# EAGLE design artboat_rev_a (EAGLE 7.3.0)
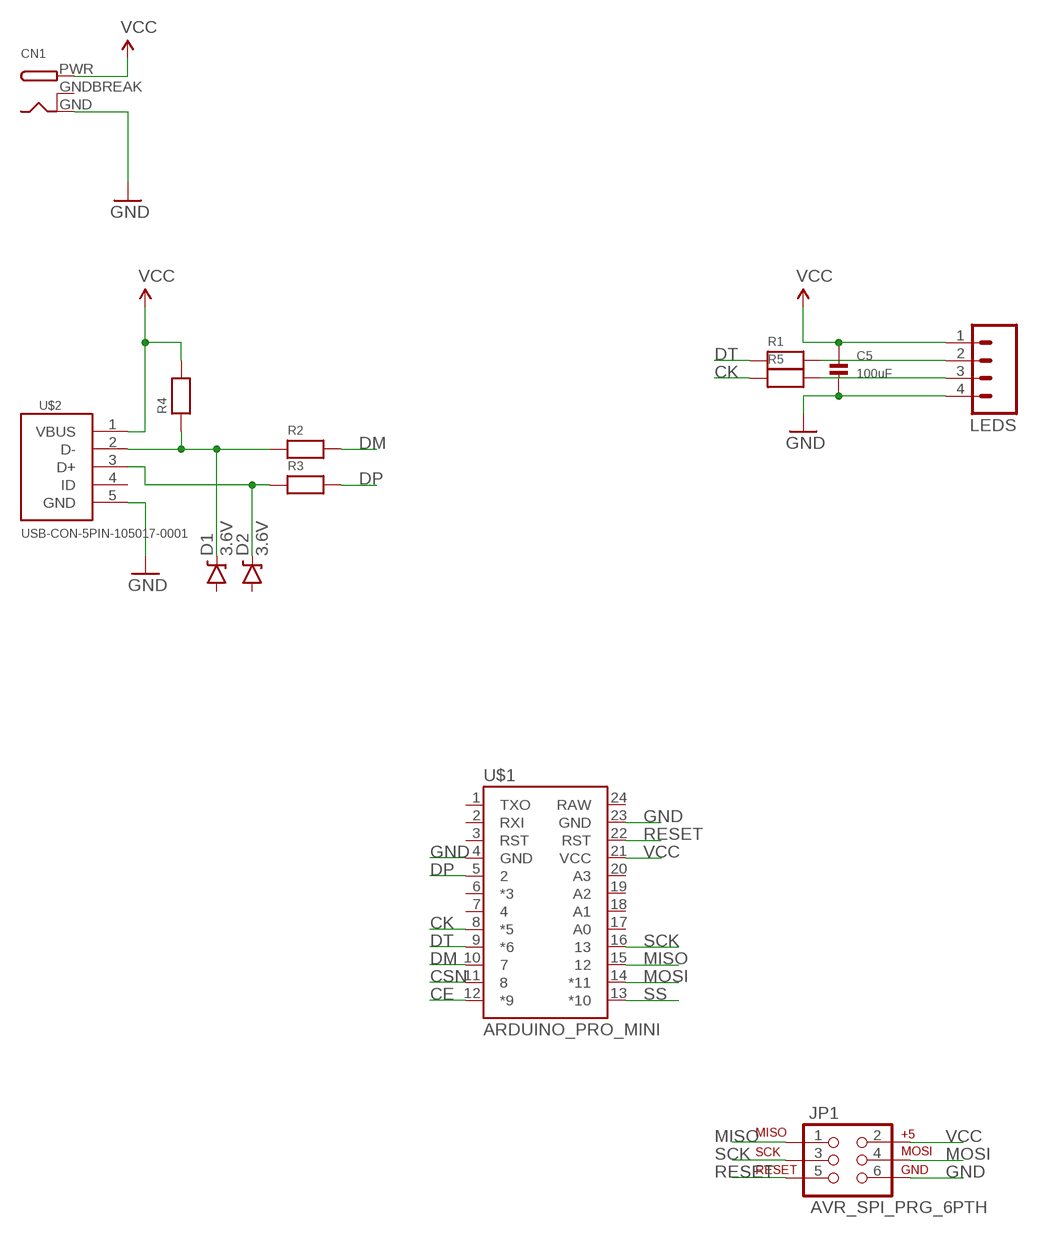
[diagram p0: schematic, sheet 1]

## Parts
C5  100uF  CAP_CERAMIC1206  [1206]
CN1  DCBARRELPTH  [DCJACK_2MM_PTH]
D1  3.6V  DIODE-ZENER3.6V  [SOD-323]
D2  3.6V  DIODE-ZENER3.6V  [SOD-323]
JP1  AVR_SPI_PRG_6PTH  [2X3]
LEDS  M04PTH  [1X04]
R1  RESISTOR_0603  [_0603]
R2  RESISTOR_0603  [_0603]
R3  RESISTOR_0603  [_0603]
R4  RESISTOR_0603  [_0603]
R5  RESISTOR_0603  [_0603]
U$1  ARDUINO_PRO_MINI  [ARDUINO_PRO_MINI]
U$2  USB-CON-5PIN-105017-0001  [USB-MICRO-MOLEX-105017-0001]

## Nets
CE: U$1.12(*9)
CK: R5.1 U$1.8(*5)
CSN: U$1.11
DM: R2.2 U$1.10
DP: R3.2 U$1.5
DT: R1.1 U$1.9(*6)
GND: C5.2 CN1.GND JP1.6 LEDS.4 U$1.4(GND) U$1.23(GND) U$2.5(GND)
MISO: JP1.1 U$1.15
MOSI: JP1.4 U$1.14(*11)
N$2: LEDS.2 LEDS.3 R1.2 R5.2
N$5: D1.C R2.1 R4.1 U$2.2(D-)
N$6: D2.C R3.1 U$2.3(D+)
RESET: JP1.5 U$1.22(RST)
SCK: JP1.3 U$1.16
SS: U$1.13(*10)
VCC: C5.1 CN1.PWR JP1.2 LEDS.1 R4.2 U$1.21(VCC) U$2.1(VBUS)
Unconnected: D1.A D2.A U$1.1(TXO) U$1.2(RXI) U$1.3(RST) U$1.6(*3) U$1.7 U$1.17(A0) U$1.18(A1) U$1.19(A2) U$1.20(A3) U$1.24(RAW) U$2.4(ID)

## Power pins joined to a net without a drawn wire
GNDBREAK: CN1.GNDBREAK

## Library data of the parts
C5 = microbuilder:CAP_CERAMIC: Ceramic Capacitors 0402 - 0402 Surface Mount Capacitors 16pF 50V 5% [Digikey: 445-4899-2-ND] 18pF 50V 5% [Digikey: 490-1281-2-ND] 22pF 50V 5% [Digikey: 490-1283-2-ND] 68pF 50V 5% [Digikey: 490-1289-2-ND] 0.1uF 10V 10% [Digikey: 490-1318-2-ND] 1.0uF 6.3V 10% [Digikey: 490-1320-2-ND] 0603 - 0603 Surface Mount Capacitors 16 pF 50V 5% [Digikey: 445-5051-2-ND] 22 pF 50V [Digikey: PCC220ACVTR-ND] 33 pF 50V 5% [Digikey: 490-1415-1-ND] 56pF 50V 5% [Digikey: 490-1421-1-ND] 220pF 50V 5% [Digikey: 445-1285-1-ND] 680 pF 50V 2200 pF 50V 5% C0G [Digikey: 445-1297-1-ND] 5600 pF 100V 5% X7R [Digikey: 478-3711-1-ND] 0.1 µF 25V 10% [Digikey: PCC2277TR-ND] 0.22 µF 16V 10% X7R [Digikey: 445-1318-1-ND] 1.0 µF 25V 10% [Digikey: 445-5146-2-ND] 0603 - RF Specific 3pF 250V +/-0.1pF RF [Digikey: 712-1347-1-ND] 18 pF 250V 5% [Digikey: 478-3505-1-ND or 712-1322-1-ND] 56 pF 250V 5% C0G RF [Digikey: 490-4867-1-ND] 68 pF 250V RF [Digikey: 490-4868-1-ND] 0805 - 0805 Surface Mount Capacitors 220 pF 250V 2% RF Ceramic Capacitor [Digikey: 712-1398-1-ND] 1000 pF 50V 2% NP0 Ceramic Capacitor [Digikey: 478-3760-1-ND] 0.1 µF 25V 10% Ceramic Capacitor [Digikey: PCC1828TR-ND] 1.0 µF 16V 10% Ceramic Capacitor[Digikey: 490-1691-2-ND] 10.0 µF 10V 10% Ceramic Capacitor[Digikey: 709-1228-1-ND] 10.0 uF 16V 10% Ceramic Capacitor [Digikey: 478-5165-2-ND] 47 uF 6.3V 20% Ceramic Capacitor [Digikey: 587-1779-1-ND or 399-5506-1-ND] 1206 - 1206 Surface Mount Capacitors 47uF 10V 20% Ceramic Capacitor [Digikey: 490-5528-1-ND or 399-5508-1-ND or 445-6010-1-ND] 100uF 6.3V -20%, +80% Y5V Ceramic Capacitor (Digikey: 490-4512-1-ND, Mouser: 81-GRM31CF50J107ZE1L)
CN1 = adafruit:DCBARREL: 2.0mm DC Barrel Jack DCJACK_2MM_PTH - Through Hole Jack (4UConnector: 05537)
D1 D2 = SparkFun-DiscreteSemi:DIODE-ZENER: Zener Diode Production Part - 8199 3.4V Zener Voltage
JP1 = SparkFun-Connectors:AVR_SPI_PRG_6: AVR ISP 6 Pin This is the reduced ISP connector for AVR programming. Common on Arduino. This footprint will take up less PCB space and can be used with a 10-pin to 6-pin adapter such as SKU: BOB-08508 **Special note about "TEST_POINT" package. The stop mask is on the top side, so if you want your programming test points to be on the bottom of your board, make sure to place this package on the bottom side of the board. This also ensure that the orientation to program from the bottom side will be correct.
LEDS = SparkFun-Connectors:M04: Header 4 Standard 4-pin 0.1" header. Use with straight break away headers (SKU : PRT-00116), right angle break away headers (PRT-00553), swiss pins (PRT-00743), machine pins (PRT-00117), and female headers (PRT-00115). Molex polarized connector foot print use with SKU : PRT-08231 with associated crimp pins and housings. 1MM SMD Version SKU: PRT-10208
R1-R5 = microbuilder:RESISTOR: Resistors 0402 - 0402 Surface Mount Package 22 Ohm 1% 1/16W [Digikey: 311-22.0LRTR-ND] 33 Ohm 5% 1/16W 1.0K 5% 1/16W 1.5K 5% 1/16W 2.0K 1% 1/16W 10.0K 1% 1/16W [Digikey: 311-10.0KLRTR-ND] 10.0K 5% 1/16W [Digikey: RMCF0402JT10K0TR-ND] 12.1K 1% 1/16W [Digikey: 311-22.0LRTR-ND] 100.0K 5% 1/16W 0603 - 0603 Surface Mount Package 0 Ohm 1/10 Watt 1% Resistor 15 Ohm 1/10 Watt 1% Resistor 33 Ohm 1/10 Watt 1% Resistor 49.9 Ohm 1/10 Watt 1% Resistor 100 Ohm 1/10 Watt 1% Resistor 150 Ohm 1/10 Watt 1% Resistor 240 Ohm 1/10 Watt 1% Resistor 390 Ohm 1/10 Watt 1% Resistor 560 Ohm 1/10 Watt 1% Resistor 680 Ohm 1/10 Watt 1% Resistor 750 Ohm 1/10 Watt 1% Resistor 1.0K Ohm 1/10 Watt 1% Resistor 1.5K Ohm 1/10 Watt 1% Resistor 2.0K Ohm 1/10 Watt 1% Resistor 2.2K Ohm 1/10 Watt 1% Resistor 3.3K Ohm 1/10 Watt 1% Resistor 4.7K Ohm 1/10 Watt 1% Resistor 10.0K Ohm 1/10 Watt 1% Resistor 12.0K Ohm 1/10 Watt 1% Resistor 12.1K Ohm 1/10 Watt 1% Resistor 20.0K Ohm 1/10 Watt 1% Resistor 33.0K Ohm 1/10 Watt 1% Resistor 100.0K Ohm 1/10 Watt 1% Resistor 0805 - 0805 Surface Mount Package 0 Ohm 1/8 Watt 1% Resistor 33 Ohm 1/8 Watt 1% Resistor 100 Ohm 1/8 Watt 1% Resistor 150 Ohm 1/8 Watt 1% Resistor 200 Ohm 1/8 Watt 1% Resistor 240 Ohm 1/8 Watt 1% Resistor 330 Ohm 1/8 Watt 1% Resistor 390 Ohm 1/8 Watt 1% Resistor 470 Ohm 1/8 Watt 1% Resistor 1.0K Ohm 1/8 Watt 1% Resistor 1.5K Ohm 1/8 Watt 1% Resistor 2.0K Ohm 1/8 Watt 1% Resistor 4.7K Ohm 1/8 Watt 1% Resistor 5.1K Ohm 1/8 Watt 1% Resistor 5.6K Ohm 1/8 Watt 1% Resistor 10.0K Ohm 1/8 Watt 1% Resistor 22.0K Ohm 1/8 Watt 1% Resistor 33.0K Ohm 1/8 Watt 1% Resistor 100K Ohm 1/8 Watt 1% Resistor 1206 - 1206 Surface Mount Package 2012 - 2010 Surface Mount Package 0.11 Ohm 1/2 Watt 1% Resistor - Digikey: RHM.11UCT-ND
U$1 = SparkFun-Boards:ARDUINO_PRO_MINI
U$2 = GeekAmmo:USB-CON-5PIN: Molex Micro USB 105017-0001

## Board
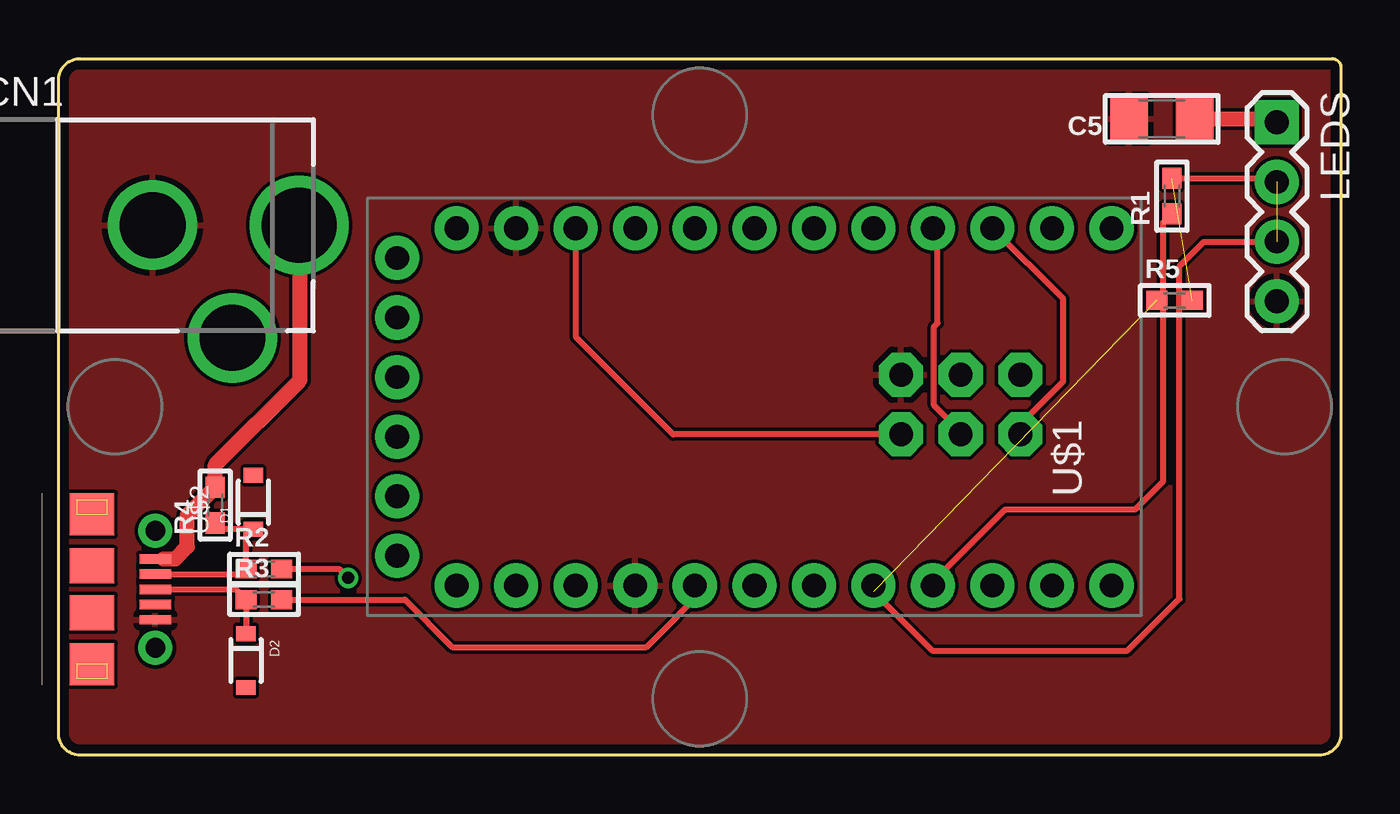
[diagram p1: board, top side]
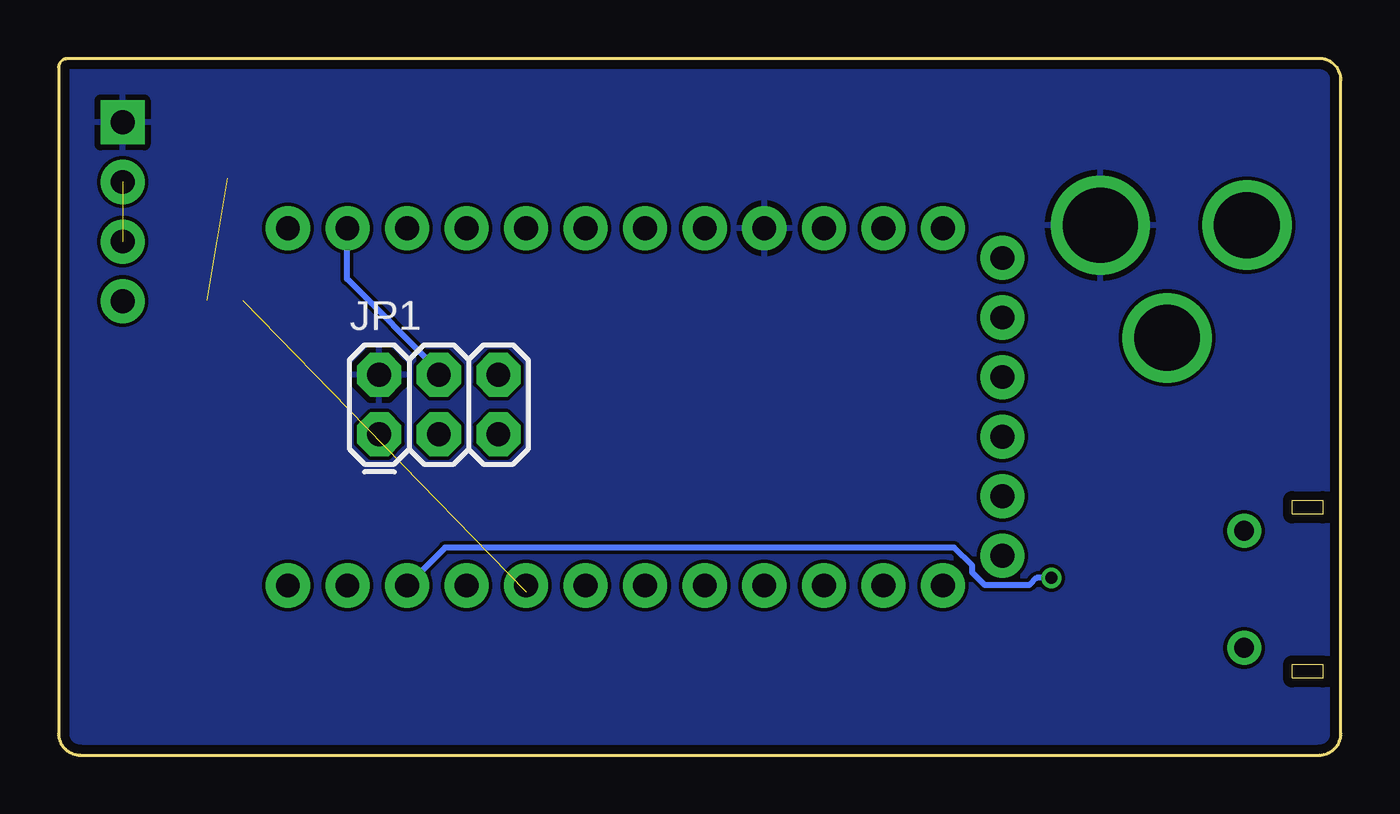
[diagram p2: board, bottom side, seen from below]

Size 54.7 x 29.7 mm. Coordinates in mm from the lower left corner, seen from the top.
Copper layers (1*16): Top 0.0356mm / dielectric 1.5011mm / Bottom 0.0356mm
Design rules "oshpark-2layer": minimum track width 6mil, minimum drill 13mil, track to track 6mil, track to pad 6mil, pad to pad 6mil, via to via 6mil, smd to smd 6mil, copper to edge 15mil, drill to drill 6mil, minimum pad ring 7mil, minimum via ring 7mil, stop-mask expansion 4mil, vias tented up to drill 0mil, thermal gap 10mil

### Footprints (pad centres in the part's own frame; a part is rotated, then mirrored left to right if it is on the bottom)
1206 = smd 1.6 x 1.8: 1 -1.4,0; 2 1.4,0
DCJACK_2MM_PTH = drill 2.8: GND 0,7.35; GNDBREAK 4.8,10.75 | drill 3.2: PWR 0,13.6
SOD-323 = smd 0.63 x 0.83: A 1.15,0; C -1.15,0
2X3 = drill 1.016 pad 1.88 octagon: 1 0,0; 2 0,2.54; 3 2.54,0; 4 2.54,2.54; 5 5.08,0; 6 5.08,2.54
1X04 = drill 1.016 pad 1.88 square: 1 0,0 | drill 1.016 pad 1.88: 2 2.54,0; 3 5.08,0; 4 7.62,0
_0603 = smd 0.9 x 0.8: 1 -0.762,0; 2 0.762,0
ARDUINO_PRO_MINI = drill 1.016 pad 1.88: 1 -7.62,12.7; 2 -7.62,10.16; 3 -7.62,7.62; 4 -7.62,5.08; 5 -7.62,2.54; 6 -7.62,0; 7 -7.62,-2.54; 8 -7.62,-5.08; 9 -7.62,-7.62; 10 -7.62,-10.16; 11 -7.62,-12.7; 12 -7.62,-15.24; 13 7.62,-15.24; 14 7.62,-12.7; 15 7.62,-10.16; 16 7.62,-7.62; 17 7.62,-5.08; 18 7.62,-2.54; 19 7.62,0; 20 7.62,2.54; 21 7.62,5.08; 22 7.62,7.62; 23 7.62,10.16; 24 7.62,12.7; BLK -6.35,15.24; GND -3.81,15.24; GRN 6.35,15.24; RXI 1.27,15.24; TXO 3.81,15.24; VCC -1.27,15.24
USB-MICRO-MOLEX-105017-0001 = smd 0.4 x 1.35: 1 1.2,0; 2 1.85,0; 3 2.5,0; 4 3.15,0; 5 3.8,0 | drill 0.85 pad 1.45: P$1 0,0; P$2 5,0 | smd 1.5 x 1.9: P$3 3.5,-2.7; P$4 1.5,-2.7 | smd 1.8 x 1.9: P$5 -0.7,-2.7; P$6 5.7,-2.7

### Placement (x,y rotation side)
C5  47.06,27.13 180 top
CN1  -3.34,22.59 270 top
D1  8.31,10.78 90 top
D2  7.99,4.03 270 top
JP1  41.02,13.68 0 bottom
LEDS  51.97,26.98 270 top
R1  47.49,23.84 90 top
R2  8.76,7.94 0 top
R3  8.76,6.63 0 top
R4  6.68,10.66 90 top
R5  47.61,19.39 0 top
U$1  29.68,14.85 90 top
U$2  4.13,9.57 270 top
U$5  [61*36-2]  27.35,14.85 0 top

### Tracks (layer width: path | path; a pad name or v marks a point on that pad's centre or on a via)
CK  (1 unrouted)
  Top 0.254: U$1.8 34.76,6.97 37.27,4.46 45.6,4.46 47.81,6.67 47.81,20.84 48.85,21.88 51.95,21.88
DM  (via drill 0.51)
  Top 0.254: R2.2 11.97,7.94 v12.35,7.56
  Bottom 0.254: v12.35,7.56 12.99,7.56 13.29,7.25 15.2,7.25 15.73,7.78 15.73,8.09 16.49,8.85 38.22,8.85 U$1.10
DP
  Top 0.254: R3.2 14.77,6.63 16.8,4.61 25.08,4.61 27.74,7.28 27.18,7.28 U$1.5
DT
  Top 0.254: U$1.9 37.3,7.38 40.39,10.48 45.93,10.48 47.12,11.67 47.12,22.71 R1.1
GND
  pour Top: 0.08,29.73 54.69,29.73 54.69,0.24 0.01,0.24 0.01,29.58 0.49,29.58
MISO
  Top 0.254: JP1.1 41.02,14.1 42.86,15.94 42.86,19.45 U$1.15
MOSI
  Bottom 0.254: JP1.4 38.48,16.39 42.4,20.31 42.4,22.45 U$1.14
N$2  (2 unrouted)
  Top 0.254: R1.2 51.81,24.6 LEDS.2
N$5
  Top 0.254: U$2.2 7.78,7.72 R2.1 8,9.32 D1.C 6.95,9.63 R4.1
N$6
  Top 0.254: U$2.3 7.56,7.07 R3.1 D2.C
RESET
  Top 0.254: JP1.5 26.22,13.68 22.08,17.82 22.08,22.45 U$1.22
SCK
  Top 0.254: JP1.3 38.48,13.78 37.34,14.92 37.34,18.27 37.5,18.43 37.5,22.27 U$1.16
VCC
  Top 0: U$2.1 4.47,8.37 4.48,8.37
  Top 0.635: 4.48,8.37 4.99,8.37 5.49,8.88 5.49,10.24 R4.2 6.68,12.37 10.29,15.99 10.29,22.56 CN1.PWR | C5.1 51.82,27.13 LEDS.1
  pour Bottom: 0.31,29.65 54.69,29.65 54.69,0.24 0.24,0.24 0.24,29.58